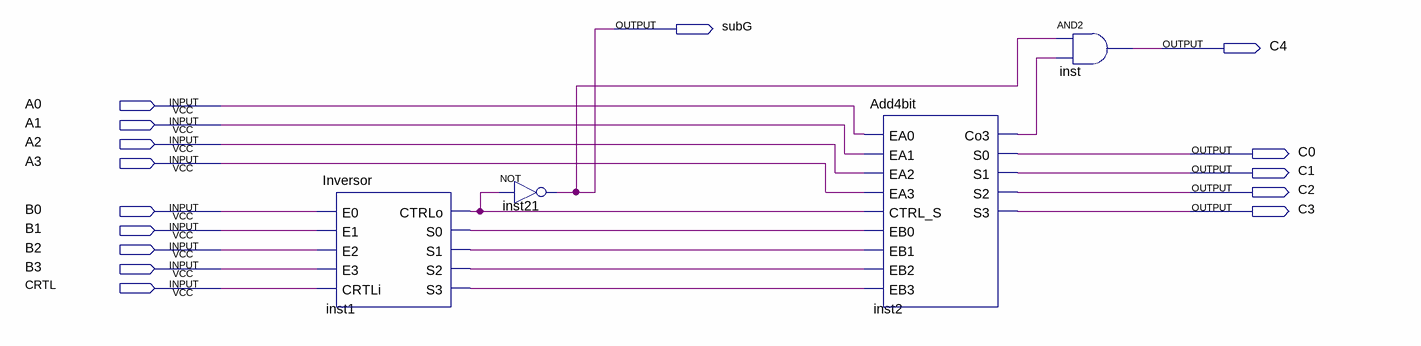
[diagram p0: schematic sheet]
// Quartus schematic FullAdder.bdf as structural Verilog: 4 symbols, 15 pins
module FullAdder (
  input  A0,
  input  A1,
  input  A2,
  input  A3,
  input  B0,
  input  B1,
  input  B2,
  input  B3,
  input  CRTL,
  output subG,
  output C4,
  output C0,
  output C1,
  output C2,
  output C3
);

  wire inst1_ctrlo, inst1_s0, inst1_s1, inst1_s2, inst1_s3, inst2_co3;

  Inversor inst1 (
    .E0(B0), .E1(B1), .E2(B2), .E3(B3), .CRTLi(CRTL), .CTRLo(inst1_ctrlo), .S0(inst1_s0), .S1(inst1_s1),
    .S2(inst1_s2), .S3(inst1_s3));
  not inst21 (subG, inst1_ctrlo);
  Add4bit inst2 (
    .EA0(A0), .EA1(A1), .EA2(A2), .EA3(A3), .CTRL_S(inst1_ctrlo), .EB0(inst1_s0), .EB1(inst1_s1),
    .EB2(inst1_s2), .EB3(inst1_s3), .Co3(inst2_co3), .S0(C0), .S1(C1), .S2(C2), .S3(C3));
  and inst (C4, subG, inst2_co3);
endmodule
